# EAGLE design Output Power Distro (EAGLE 9.4.2)
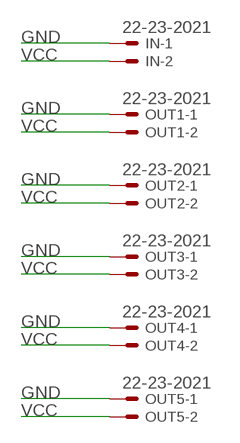
[diagram p0: schematic, sheet 1]

## Parts
IN  22-23-2021  [22-23-2021]
OUT1  22-23-2021  [22-23-2021]
OUT2  22-23-2021  [22-23-2021]
OUT3  22-23-2021  [22-23-2021]
OUT4  22-23-2021  [22-23-2021]
OUT5  22-23-2021  [22-23-2021]

## Nets
GND: IN.1 OUT1.1 OUT2.1 OUT3.1 OUT4.1 OUT5.1
VCC: IN.2 OUT1.2 OUT2.2 OUT3.2 OUT4.2 OUT5.2

## Library data of the parts
IN OUT1-OUT5 = con-molex:22-23-2021: .100" (2.54mm) Center Header - 2 Pin; MF: MOLEX; MPN: 22-23-2021; OC_FARNELL: 1462926; OC_NEWARK: 25C3832

## Board
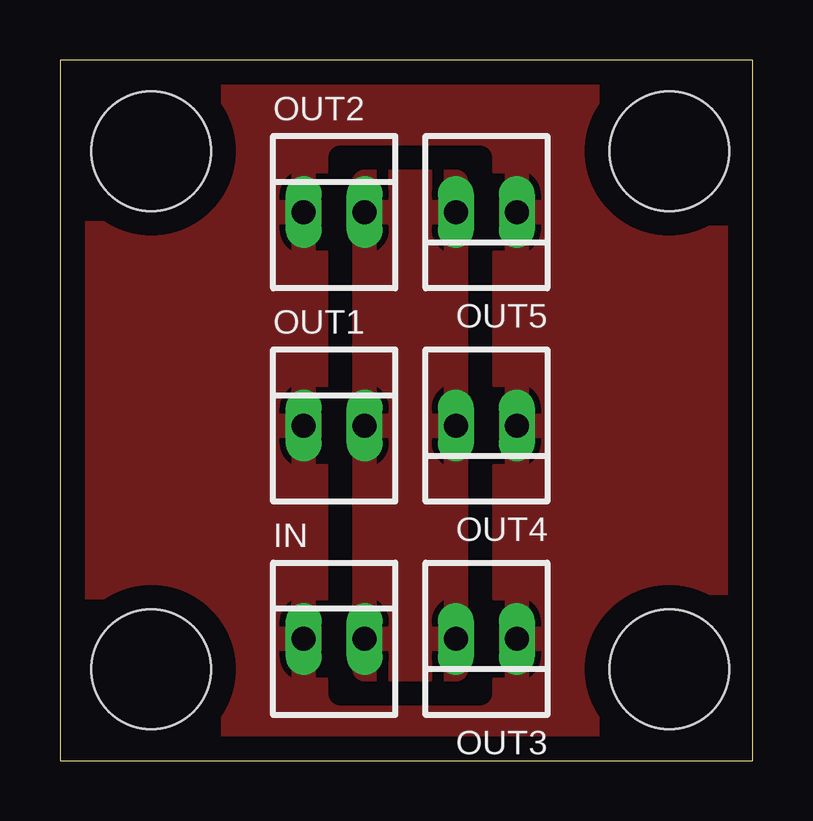
[diagram p1: board, top side]
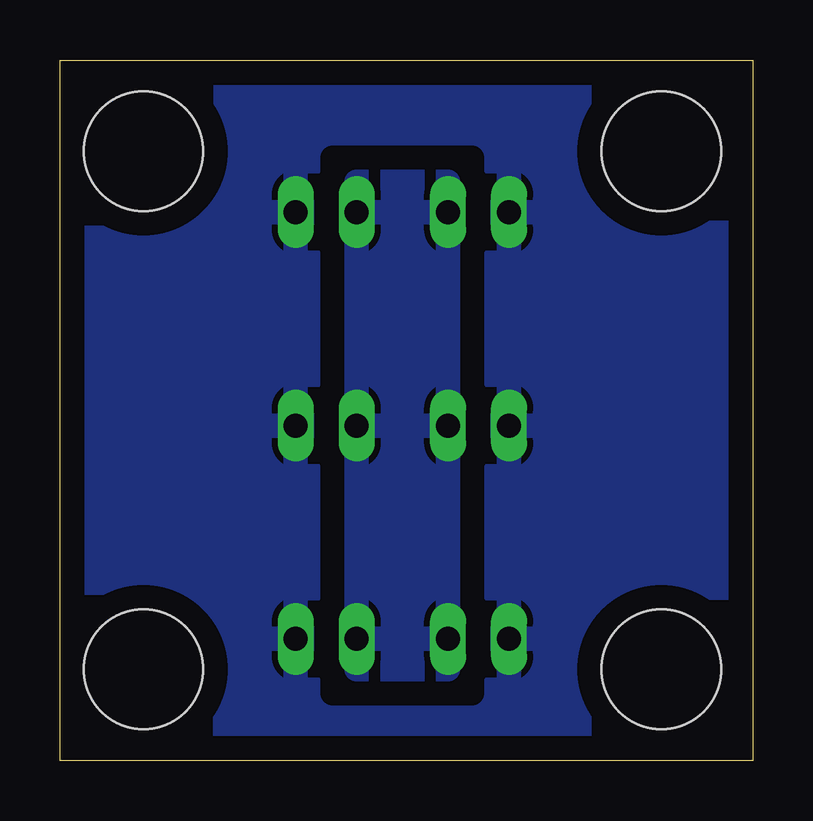
[diagram p2: board, bottom side, seen from below]

Size 28.88 x 29.2 mm. Coordinates in mm from the lower left corner, seen from the top.
Outline: 0,0 28.88,0 28.88,29.2 0,29.2 0,0
Copper layers (1*16): Top 0.035559375mm / dielectric 1.6mm / Bottom 0.035559375mm
Design rules "default": minimum track width 6mil, minimum drill 10mil, track to track 6mil, track to pad 6mil, pad to pad 6mil, via to via 6mil, smd to smd 6mil, copper to edge 15mil, drill to drill 6mil, minimum pad ring 5mil, minimum via ring 5mil, stop-mask expansion 2.5mil, vias tented up to drill 0mil, thermal gap 10mil
Holes 4.98 mm at 3.81,3.81 3.81,25.4 25.4,3.81 25.4,25.4

### Footprints (pad centres in the part's own frame; a part is rotated, then mirrored left to right if it is on the bottom)
22-23-2021 = drill 1 long: 1 -1.27,0; 2 1.27,0

### Placement (x,y rotation side)
IN  11.43,5.08 0 top
OUT1  11.43,13.97 0 top
OUT2  11.43,22.86 0 top
OUT3  17.78,5.08 180 top
OUT4  17.78,13.97 180 top
OUT5  17.78,22.86 180 top

### Tracks (layer width: path | path; a pad name or v marks a point on that pad's centre or on a via)
GND
  pour Top (isolate 1.016, rank 2): 0,29.21 29.21,29.21 29.21,0 0,0
  pour Bottom (isolate 1.016, rank 2): 0,29.21 29.21,29.21 29.21,5.08 31.75,2.54 31.75,0 0,0
VCC
  pour Top (isolate 1.016): 12.7,3.81 16.51,3.81 16.51,24.13 12.7,24.13
  pour Bottom (isolate 1.016): 12.7,24.13 16.51,24.13 16.51,3.81 12.7,3.81